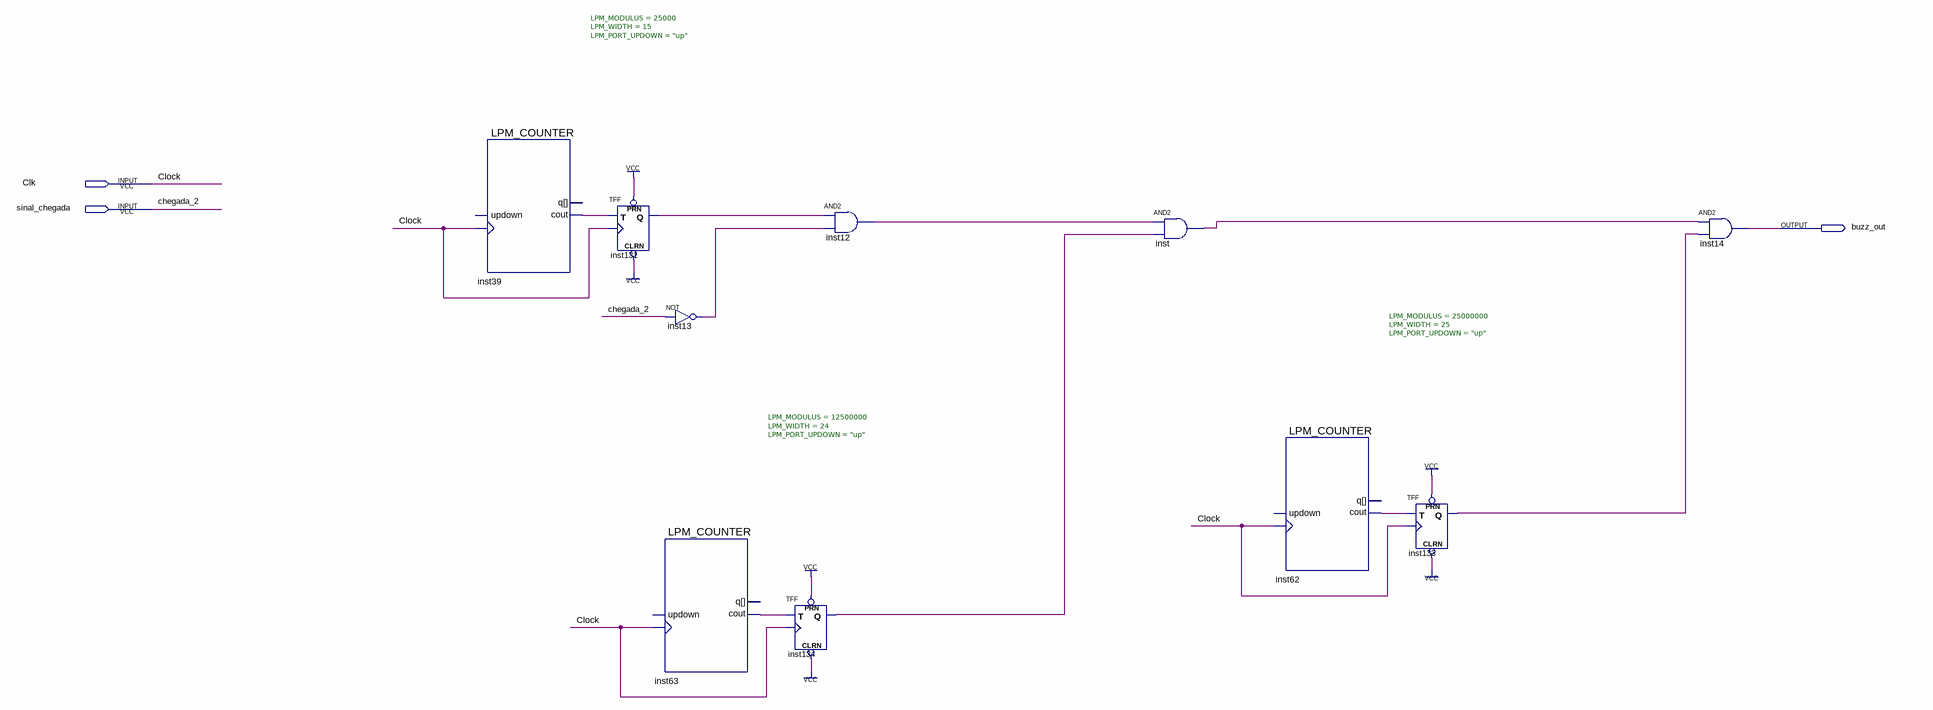
[diagram p0: schematic sheet]
// Quartus schematic alarme2.bdf as structural Verilog: 10 symbols, 3 pins
module alarme2 (
  input  Clk,
  input  sinal_chegada,
  output buzz_out
);

  wire inst12_out, inst13_out, inst39_cout, inst62_cout, inst63_cout, inst131_q, inst133_q, inst134_q,
       inst_out;

  LPM_COUNTER #(.LPM_MODULUS(25000), .LPM_WIDTH(15), .LPM_PORT_UPDOWN("up")) inst39 (
    .clock(Clk), .cout(inst39_cout));  // open: updown, q
  TFF inst131 (.PRN(1'b1), .CLRN(1'b1), .T(inst39_cout), .CLK(Clk), .Q(inst131_q));
  LPM_COUNTER #(.LPM_MODULUS(12500000), .LPM_WIDTH(24), .LPM_PORT_UPDOWN("up")) inst63 (
    .clock(Clk), .cout(inst63_cout));  // open: updown, q
  not inst13 (inst13_out, sinal_chegada);
  TFF inst134 (.PRN(1'b1), .CLRN(1'b1), .T(inst63_cout), .CLK(Clk), .Q(inst134_q));
  and inst12 (inst12_out, inst131_q, inst13_out);
  and inst (inst_out, inst12_out, inst134_q);
  LPM_COUNTER #(.LPM_MODULUS(25000000), .LPM_WIDTH(25), .LPM_PORT_UPDOWN("up")) inst62 (
    .clock(Clk), .cout(inst62_cout));  // open: updown, q
  TFF inst133 (.PRN(1'b1), .CLRN(1'b1), .T(inst62_cout), .CLK(Clk), .Q(inst133_q));
  and inst14 (buzz_out, inst_out, inst133_q);

  // Other names for the same wires on the sheet: chegada_2 = sinal_chegada; Clock = Clk
endmodule
